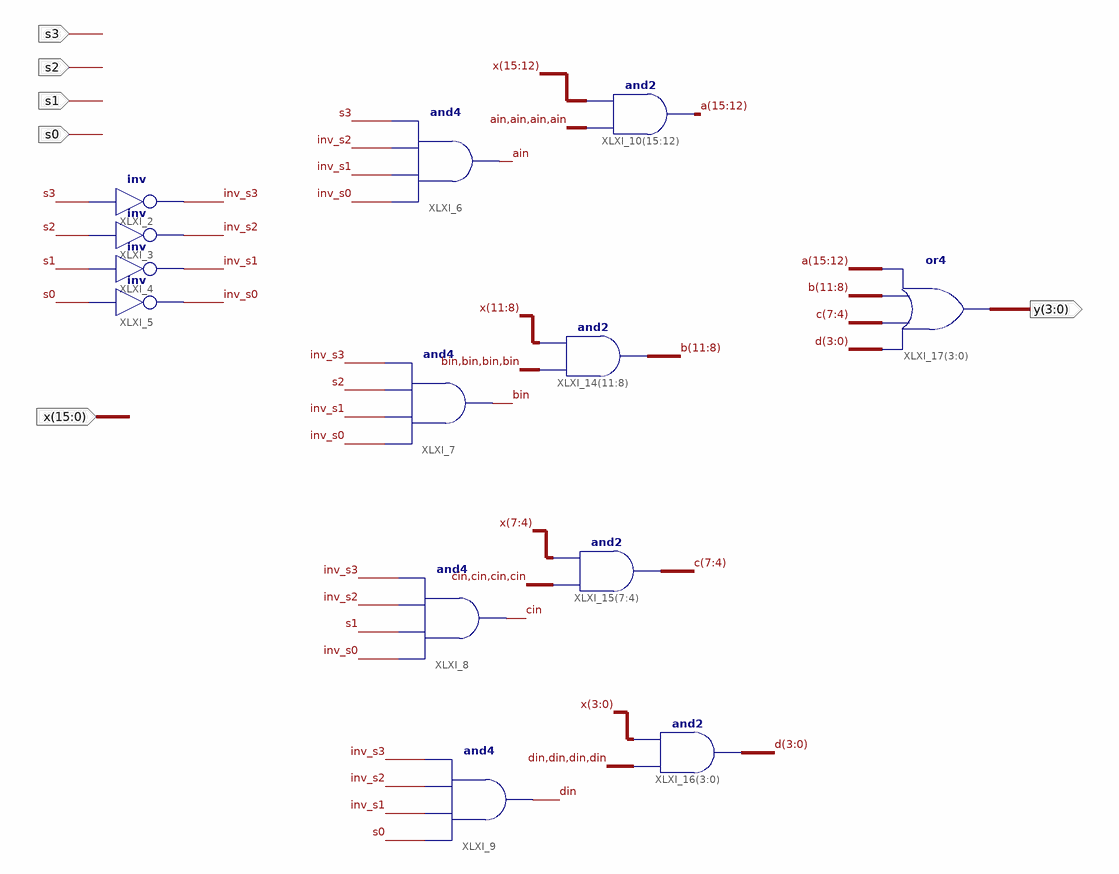
[diagram p0: schematic sheet 1]
// Xilinx ISE schematic Selector.sch (spartan3e) as structural Verilog: 13 symbols, 6 ports
module Selector (
  input  s3,
  input  s2,
  input  s1,
  input  s0,
  input  [15:0] x,
  output [3:0] y
);

  wire ain, bin, cin, din, inv_s0, inv_s1, inv_s2, inv_s3;
  wire [3:0] d;
  wire [7:4] c;
  wire [11:8] b;
  wire [15:12] a;

  not XLXI_2 (inv_s3, s3);
  not XLXI_3 (inv_s2, s2);
  not XLXI_4 (inv_s1, s1);
  not XLXI_5 (inv_s0, s0);
  assign y = d | c | b | a;  // or4 XLXI_17[3..0], 4 bits wide
  and XLXI_9 (din, s0, inv_s1, inv_s2, inv_s3);
  assign d = {4{din}} & x[3:0];  // and2 XLXI_16[3..0], 4 bits wide
  and XLXI_8 (cin, inv_s0, s1, inv_s2, inv_s3);
  assign c = {4{cin}} & x[7:4];  // and2 XLXI_15[7..4], 4 bits wide
  and XLXI_7 (bin, inv_s0, inv_s1, s2, inv_s3);
  assign b = {4{bin}} & x[11:8];  // and2 XLXI_14[11..8], 4 bits wide
  and XLXI_6 (ain, inv_s0, inv_s1, inv_s2, s3);
  assign a = {4{ain}} & x[15:12];  // and2 XLXI_10[15..12], 4 bits wide
endmodule
